# Altium schematic sheet BatteryCharger.SchDoc
size A4
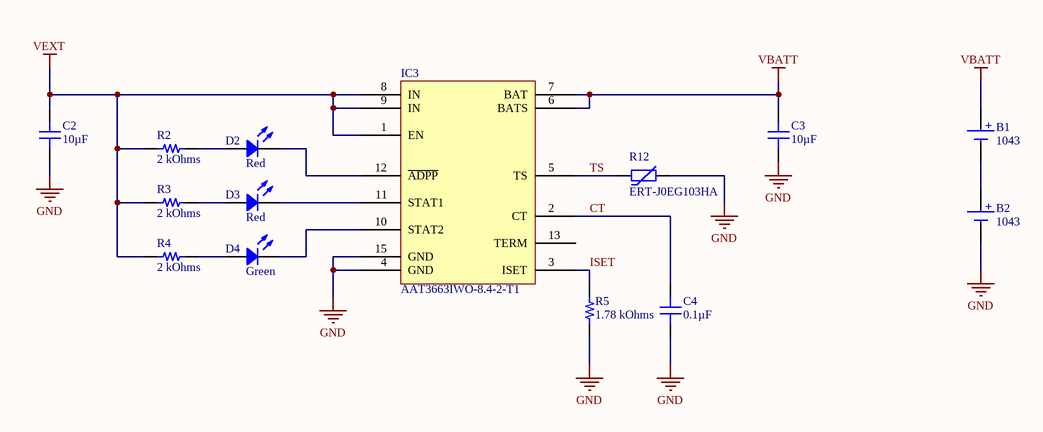
[diagram p0: BatteryCharger.SchDoc]

## Parts
B1  1043  [KEYSTONE 1043]
B2  1043  [KEYSTONE 1043]
C2  10µF  [CAP 1206_3216 - 1.8MM]
C3  10µF  [CAP 1206_3216 - 1.8MM]
C4  0.1µF  [CAP 0603_1608]
D2  Red  [LED 0603_1608 RED]
D3  Red  [LED 0603_1608 RED]
D4  Green  [LED 0603_1608 GREEN]
IC3  AAT3663IWO-8.4-2-T1  [SKYWORKS TDFN-14 3X3MM]
R2  2 kOhms  [RES 0603_1608]
R3  2 kOhms  [RES 0603_1608]
R4  2 kOhms  [RES 0603_1608]
R5  1.78 kOhms  [RES 0603_1608]
R12  ERT-J0EG103HA  [NTC 0402_1005]

## Nets
GND: B2.2(-) C2.1 C3.1 C4.1 IC3.4(GND) IC3.15(GND) R5.1 R12.2
VBATT: B1.1(+) C3.2 IC3.6(BATS) IC3.7(BAT)
VEXT: C2.2 IC3.1(EN) IC3.8(IN) IC3.9(IN) R2.1 R3.1 R4.1
CT: C4.2 IC3.2(CT)
ISET: IC3.3(ISET) R5.2
TS: IC3.5(TS) R12.1
NetB1_2: B1.2(-) B2.1(+)
NetD2_1: D2.1 R2.2
NetD2_2: D2.2 IC3.12(~{ADPP})
NetD3_1: D3.1 R3.2
NetD3_2: D3.2 IC3.11(STAT1)
NetD4_1: D4.1 R4.2
NetD4_2: D4.2 IC3.10(STAT2)

Not connected (* = marked no-connect by the designer): IC3 13(TERM)

## Notes on the sheet
- Title
- Size:
- Date:
- A4
- Number:
- Time:
- Revision:
- Sheet
- of
- File:

## Library data of the parts
B1 B2 = 1043: BATTERY HOLDER 18650 PC PIN; Manufacturer: Keystone Electronics; Battery Cell Size: 18650; Battery Type, Function: Cylindrical, Holder; Number of Cells: 1; Style: Holder (Open); Part Number: 1043; ComponentLink1Description: Datasheet; ComponentLink1URL: http://keyelco.com/userAssets/file/M65p27.pdf; ComponentLink2Description: DigiKey Link; ComponentLink2URL: http://digikey.com/product-detail/en/keystone-electronics/1043/36-1043-ND/2745669; Height Above Board: 0.585" (14.86mm); LastUpdated: 02/02/2020 09:19:56; Lifecycle Status: Active; Minimum Order: 1; Mounting Type: PCB, Through Hole; Operating Temperature: -50°C ~ 145°C; Packaging: Unknown; PartId: 2; Part Status: Active; Price: 2.58; Series: -; Supplier 1: DigiKey; Supplier Part Number 1: 36-1043-ND; Termination Style: PC Pin
C2 C3 = CL31A106KPHNNNE: CAP CER 10UF 10V X5R 1206; Manufacturer: Samsung Electro-Mechanics; Tolerance: ±10%; Part Number: CL31A106KPHNNNE; Value: 10µF; Applications: General Purpose; Capacitance: 10µF; ComponentLink1Description: Datasheet; ComponentLink1URL: http://www.samsungsem.com/kr/support/product-search/mlcc/CL31A106KPHNNNE.jsp; ComponentLink2Description: DigiKey Link; ComponentLink2URL: http://digikey.com/product-detail/en/samsung-electro-mechanics/CL31A106KPHNNNE/1276-1148-1-ND/3889234; Device Package: 1206 (3216 Metric); LastUpdated: 21/01/2020 00:03:41; Lifecycle Status: Active; Minimum Order: 1; Mounting Type: Surface Mount, MLCC; Operating Temperature: -55°C ~ 85°C; Package / Case: 1206 (3216 Metric); Packaging: TapeAndReel; PartId: 21985; Part Status: Active; Price: 0.04; Series: CL; Size / Dimension: 0.126" L x 0.063" W (3.20mm x 1.60mm); Supplier 1: DigiKey; Supplier Part Number 1: 1276-1148-1-ND; Temperature Coefficient: X5R; Thickness (Max): 0.071" (1.80mm); Voltage - Rated: 10V
C4 = CC0603MRY5V8BB104: CAP CER 0.1UF 25V Y5V 0603; Manufacturer: Yageo; Temperature Coefficient: Y5V (F); Tolerance: ±20%; Part Number: CC0603MRY5V8BB104; Value: 0.1µF; Applications: General Purpose; Capacitance: 0.1µF; ComponentLink1Description: Datasheet; ComponentLink1URL: http://www.yageo.com/documents/recent/UPY-GPHC_Y5V_6.3V-to-50V_8.pdf; ComponentLink2Description: DigiKey Link; ComponentLink2URL: http://digikey.com/product-detail/en/yageo/CC0603MRY5V8BB104/311-1363-1-ND/2103147; Device Package: 0603 (1608 Metric); LastUpdated: 21/01/2020 00:02:05; Lifecycle Status: Active; Minimum Order: 1; Mounting Type: Surface Mount, MLCC; Operating Temperature: -30°C ~ 85°C; Package / Case: 0603 (1608 Metric); Packaging: TapeAndReel; PartId: 5132; Part Status: Active; Price: 0.01; Series: CC; Size / Dimension: 0.063" L x 0.031" W (1.60mm x 0.80mm); Supplier 1: DigiKey; Supplier Part Number 1: 311-1363-1-ND; Thickness (Max): 0.035" (0.90mm); Voltage - Rated: 25V
D2 D3 = 19-213USRC/S259/TR8: LED RED CLEAR 2SMD; Manufacturer: Everlight Electronics Co Ltd; Configuration: Standard; Current - Test: 25mA; Lens Color: Colorless; Lens Size: 1.20mm x 0.80mm; Lens Style: Rectangle with Flat Top; Viewing Angle: 120°; Voltage - Forward (Vf) (Typ): 2.1V; Wavelength - Peak: 639nm; Part Number: 19-213USRC/S259/TR8; Color: Red; ComponentLink1Description: Datasheet; ComponentLink1URL: //media.digikey.com/pdf/Data%20Sheets/Everlight%20PDFs/19-213USRC-S259-TR8.pdf; ComponentLink2Description: DigiKey Link; ComponentLink2URL: http://digikey.com/product-detail/en/everlight-electronics-co-ltd/19-213USRC-S259-TR8/1080-1583-1-ND/8535306; Device Package: 0603 (1608 Metric); Height (Max): 0.70mm; LastUpdated: 21/01/2020 03:13:21; Lens Transparency: Clear; Lifecycle Status: Active; Minimum Order: 1; Mounting Type: Surface Mount; Package / Case: 0603 (1608 Metric); Packaging: TapeAndReel; PartId: 415; Part Status: Active; Price: 0.03; Series: -; Size / Dimension: 1.60mm L x 0.80mm W; Supplier 1: DigiKey; Supplier Part Number 1: 1080-1583-1-ND; Supplier Device Package: 2-SMD; Value: Red
D4 = LTST-C190KGKT: LED GREEN CLEAR CHIP SMD; Manufacturer: Lite-On Inc.; Configuration: Standard; Current - Test: 20mA; Lens Color: Colorless; Lens Size: 1.10mm x 0.80mm; Lens Style: Rectangle with Flat Top; Millicandela Rating: 35mcd; Viewing Angle: 130°; Voltage - Forward (Vf) (Typ): 2V; Wavelength - Dominant: 571nm; Wavelength - Peak: 574nm; Part Number: LTST-C190KGKT; Color: Green; ComponentLink1Description: Datasheet; ComponentLink1URL: http://optoelectronics.liteon.com/upload/download/DS22-2000-074/LTST-C190KGKT.PDF; ComponentLink2Description: DigiKey Link; ComponentLink2URL: http://digikey.com/product-detail/en/lite-on-inc/LTST-C190KGKT/160-1435-1-ND/386814; Device Package: 0603 (1608 Metric); Height (Max): 0.90mm; LastUpdated: 21/01/2020 03:12:09; Lens Transparency: Clear; Lifecycle Status: Active; Minimum Order: 1; Mounting Type: Surface Mount; Package / Case: 0603 (1608 Metric); Packaging: TapeAndReel; PartId: 657; Part Status: Active; Price: 0.04; Series: -; Size / Dimension: 1.60mm L x 0.80mm W; Supplier 1: DigiKey; Supplier Part Number 1: 160-1435-1-ND; Supplier Device Package: Chip LED; Value: Green
IC3 = AAT3663IWO-8.4-2-T1: IC LI-ION CHARGER 14-DFN; Manufacturer: Skyworks Solutions Inc.; Battery Chemistry: Lithium Ion/Polymer; Battery Pack Voltage: 8.4V; Charge Current - Max: 1A; Current - Charging: Constant - Programmable; Fault Protection: Over Current, Over Temperature, Over Voltage, Short Circuit; Interface: USB; Number of Cells: 2; Programmable Features: Current; Voltage - Supply (Max): 13.2V; Part Number: AAT3663IWO-8.4-2-T1; ComponentLink1Description: Datasheet; ComponentLink1URL: http://www.skyworksinc.com/uploads/documents/AAT3663_201878C.pdf; ComponentLink2Description: DigiKey Link; ComponentLink2URL: //digikey.com/product-detail/en/skyworks-solutions-inc/AAT3663IWO-8.4-2-T1/863-1544-2-ND/4753043; Device Package: 14-WFDFN Exposed Pad; LastUpdated: 06/12/2019 02:00:27; Lifecycle Status: 0; Minimum Order: 1; Mounting Type: Surface Mount; Operating Temperature: -40°C ~ 85°C (TA); Package / Case: 14-WFDFN Exposed Pad; Packaging: TapeAndReel; PartId: 23; Part Status: Active; Price: 0.78; Series: BatteryManager™; Supplier 1: DigiKey; Supplier Part Number 1: 863-1544-2-ND; Supplier Device Package: 14-TDFN (3x3)
R2-R4 = ERJ-PA3J202V: RES SMD 2K OHM 5% 1/4W 0603; Manufacturer: Panasonic Electronic Components; Power (Watts): 0.25W, 1/4W; Temperature Coefficient: ±200ppm/°C; Part Number: ERJ-PA3J202V; Value: 2 kOhms; ComponentLink1Description: Datasheet; ComponentLink1URL: https://industrial.panasonic.com/cdbs/www-data/pdf/RDO0000/AOA0000C331.pdf; ComponentLink2Description: DigiKey Link; ComponentLink2URL: http://digikey.com/product-detail/en/panasonic-electronic-components/ERJ-PA3J202V/P2KBZCT-ND/5036279; Composition: Thick Film; Device Package: 0603 (1608 Metric); Features: Automotive AEC-Q200, Pulse Withstanding; Height - Seated (Max): 0.022" (0.55mm); LastUpdated: 21/01/2020 00:23:23; Lifecycle Status: Active; Minimum Order: 1; Number of Terminations: 2; Operating Temperature: -55°C ~ 155°C; Package / Case: 0603 (1608 Metric); Packaging: TapeAndReel; PartId: 8961; Part Status: Active; Price: 0.01; Ratings: AEC-Q200; Resistance: 2 kOhms; Series: ERJ; Size / Dimension: 0.063" L x 0.031" W (1.60mm x 0.80mm); Supplier 1: DigiKey; Supplier Part Number 1: P2KBZCT-ND; Supplier Device Package: 0603; Tolerance: ±5%
R5 = ERJ-3EKF1781V: RES SMD 1.78K OHM 1% 1/10W 0603; Manufacturer: Panasonic Electronic Components; Power (Watts): 0.1W, 1/10W; Temperature Coefficient: ±100ppm/°C; Part Number: ERJ-3EKF1781V; Value: 1.78 kOhms; ComponentLink1Description: Datasheet; ComponentLink1URL: https://industrial.panasonic.com/cdbs/www-data/pdf/RDA0000/AOA0000C304.pdf; ComponentLink2Description: DigiKey Link; ComponentLink2URL: http://digikey.com/product-detail/en/panasonic-electronic-components/ERJ-3EKF1781V/P1.78KHCT-ND/198095; Composition: Thick Film; Device Package: 0603 (1608 Metric); Features: Automotive AEC-Q200; Height - Seated (Max): 0.022" (0.55mm); LastUpdated: 21/01/2020 00:14:46; Lifecycle Status: Active; Minimum Order: 1; Number of Terminations: 2; Operating Temperature: -55°C ~ 155°C; Package / Case: 0603 (1608 Metric); Packaging: TapeAndReel; PartId: 25984; Part Status: Active; Price: 0.01; Ratings: AEC-Q200; Resistance: 1.78 kOhms; Series: ERJ; Size / Dimension: 0.063" L x 0.031" W (1.60mm x 0.80mm); Supplier 1: DigiKey; Supplier Part Number 1: P1.78KHCT-ND; Supplier Device Package: 0603; Tolerance: ±1%
R12 = ERT-J0EG103HA: THERMISTOR NTC 10KOHM 3380K 0402; Manufacturer: Panasonic Electronic Components; B25/85: 3435K; B Value Tolerance: ±1%; Power - Max: 66mW; Resistance in Ohms @ 25°C: 10k; Resistance Tolerance: ±3%; Part Number: ERT-J0EG103HA; B25/50: 3380K; ComponentLink1Description: Datasheet; ComponentLink1URL: https://industrial.panasonic.com/cdbs/www-data/pdf/AUA0000/AUA0000C8.pdf; ComponentLink2Description: DigiKey Link; ComponentLink2URL: http://digikey.com/product-detail/en/panasonic-electronic-components/ERT-J0EG103HA/P12009CT-ND/526626; Device Package: 0402 (1005 Metric); LastUpdated: 21/01/2020 03:30:34; Lifecycle Status: Active; Minimum Order: 1; Mounting Type: Surface Mount; Operating Temperature: -40°C ~ 125°C; Package / Case: 0402 (1005 Metric); Packaging: TapeAndReel; PartId: 42; Part Status: Active; Price: 0.03; Series: ERT-J; Supplier 1: DigiKey; Supplier Part Number 1: P12009CT-ND